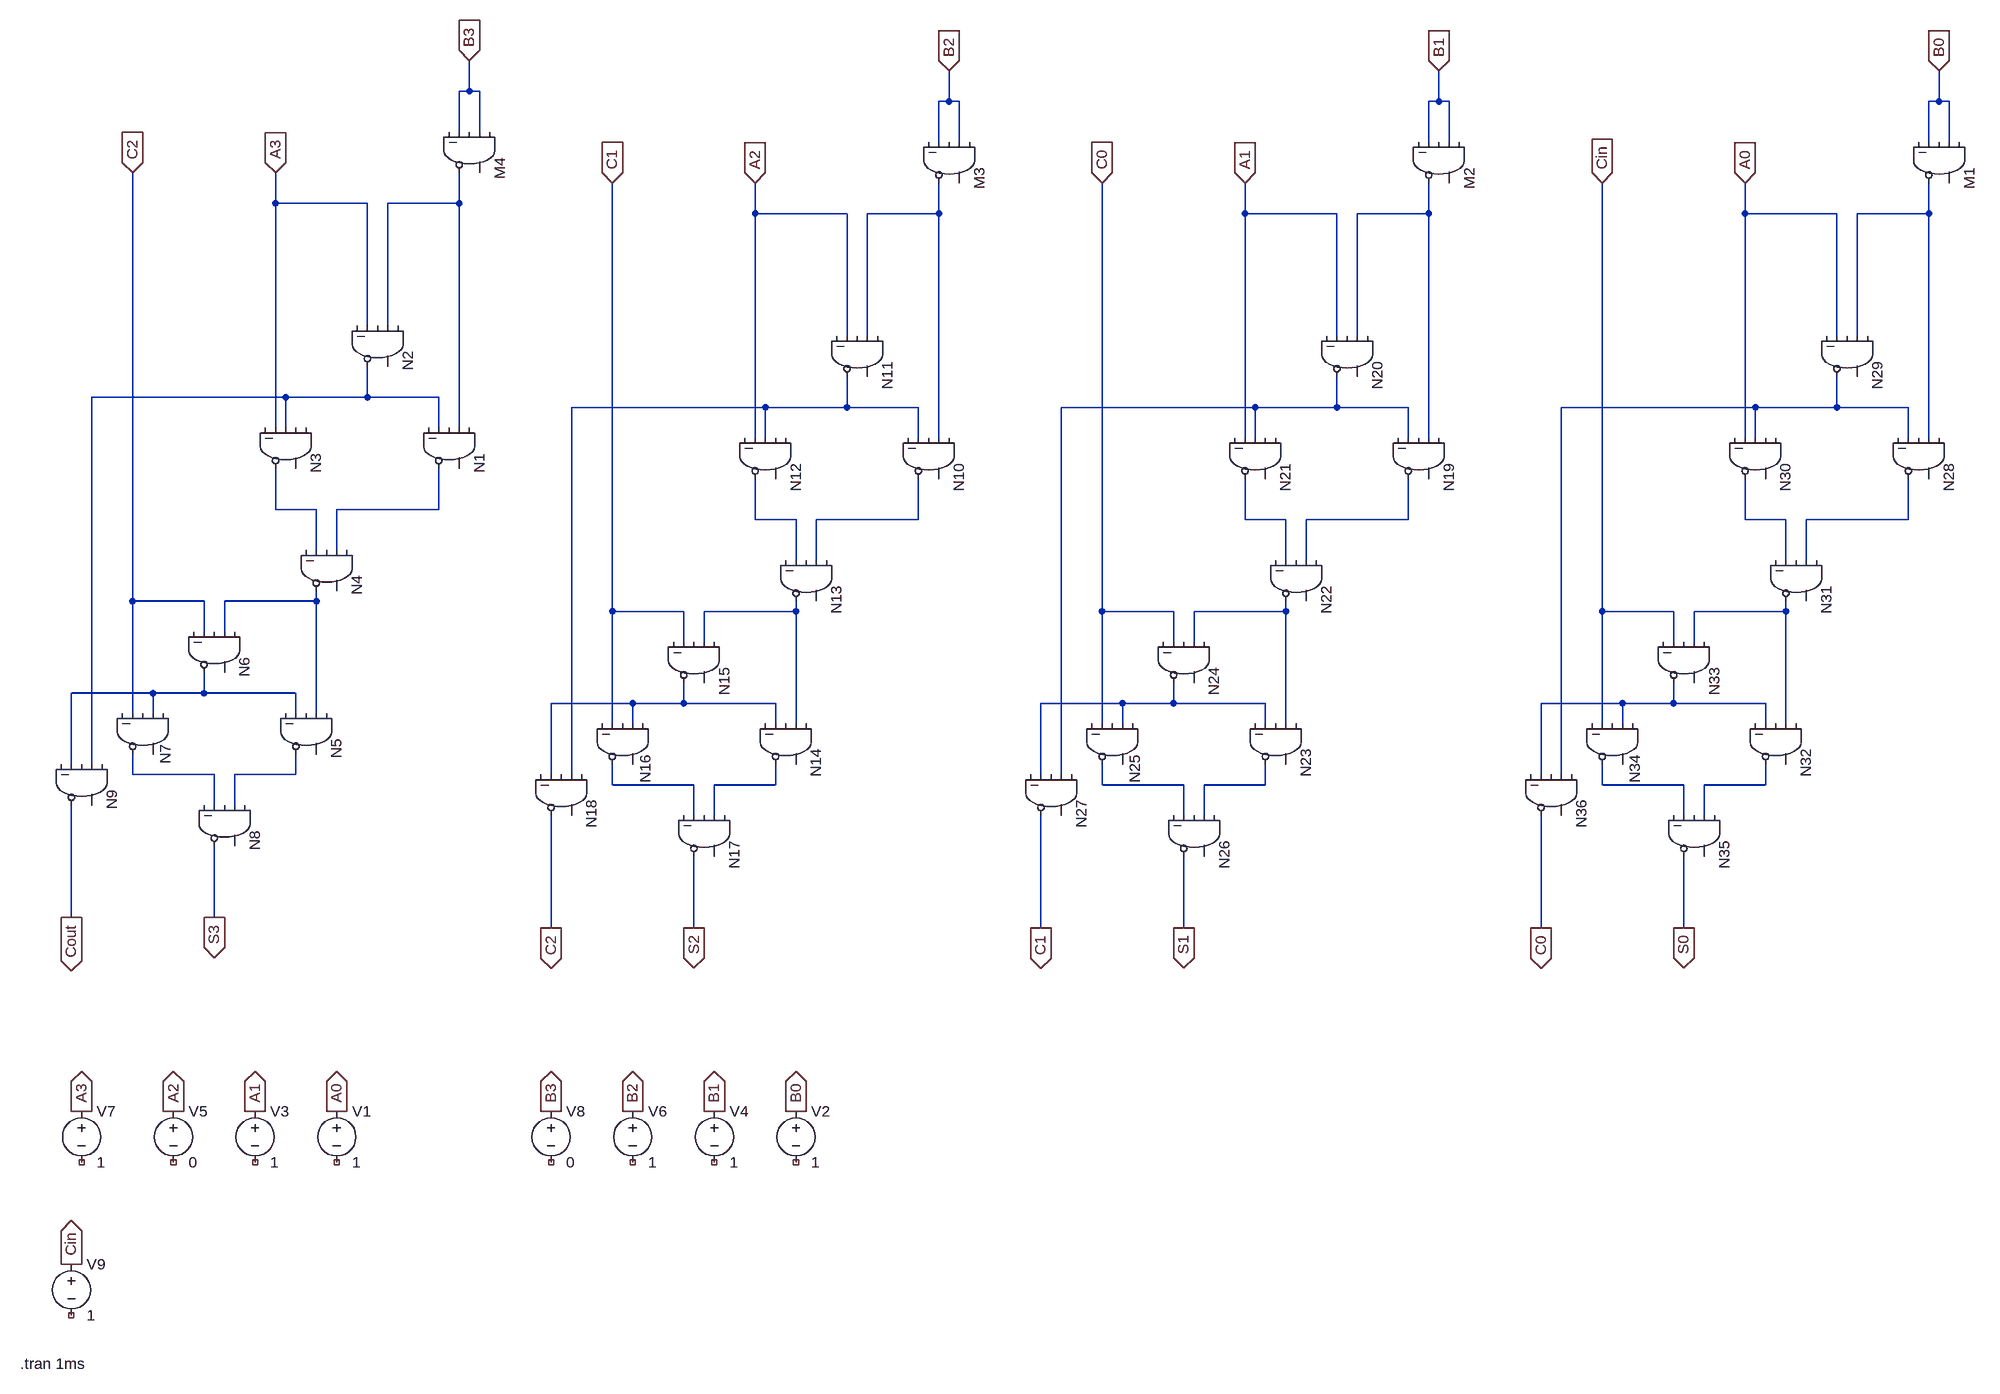
[diagram p0: schematic P3.asc]
P3.asc, the LTspice schematic file:
Version 4
SHEET 1 4360 2320
WIRE 1984 -2144 1984 -2192
WIRE 1984 -2144 1968 -2144
WIRE 2000 -2144 1984 -2144
WIRE 2736 -2128 2736 -2176
WIRE 2736 -2128 2720 -2128
WIRE 2752 -2128 2736 -2128
WIRE 3504 -2128 3504 -2176
WIRE 3504 -2128 3488 -2128
WIRE 3520 -2128 3504 -2128
WIRE 4288 -2128 4288 -2176
WIRE 4288 -2128 4272 -2128
WIRE 4304 -2128 4288 -2128
WIRE 1968 -2080 1968 -2144
WIRE 2000 -2080 2000 -2144
WIRE 2720 -2064 2720 -2128
WIRE 2752 -2064 2752 -2128
WIRE 3488 -2064 3488 -2128
WIRE 3520 -2064 3520 -2128
WIRE 4272 -2064 4272 -2128
WIRE 4304 -2064 4304 -2128
WIRE 1680 -1968 1680 -2016
WIRE 1824 -1968 1680 -1968
WIRE 1968 -1968 1968 -2016
WIRE 1968 -1968 1856 -1968
WIRE 2432 -1952 2432 -2000
WIRE 2576 -1952 2432 -1952
WIRE 2720 -1952 2720 -2000
WIRE 2720 -1952 2608 -1952
WIRE 3200 -1952 3200 -2000
WIRE 3344 -1952 3200 -1952
WIRE 3488 -1952 3488 -2000
WIRE 3488 -1952 3376 -1952
WIRE 3984 -1952 3984 -2000
WIRE 4128 -1952 3984 -1952
WIRE 4272 -1952 4272 -2000
WIRE 4272 -1952 4160 -1952
WIRE 1824 -1776 1824 -1968
WIRE 1856 -1776 1856 -1968
WIRE 2576 -1760 2576 -1952
WIRE 2608 -1760 2608 -1952
WIRE 3344 -1760 3344 -1952
WIRE 3376 -1760 3376 -1952
WIRE 4128 -1760 4128 -1952
WIRE 4160 -1760 4160 -1952
WIRE 1696 -1664 1392 -1664
WIRE 1824 -1664 1824 -1712
WIRE 1824 -1664 1696 -1664
WIRE 1936 -1664 1824 -1664
WIRE 2448 -1648 2144 -1648
WIRE 2576 -1648 2576 -1696
WIRE 2576 -1648 2448 -1648
WIRE 2688 -1648 2576 -1648
WIRE 3216 -1648 2912 -1648
WIRE 3344 -1648 3344 -1696
WIRE 3344 -1648 3216 -1648
WIRE 3456 -1648 3344 -1648
WIRE 4000 -1648 3696 -1648
WIRE 4128 -1648 4128 -1696
WIRE 4128 -1648 4000 -1648
WIRE 4240 -1648 4128 -1648
WIRE 1680 -1616 1680 -1968
WIRE 1696 -1616 1696 -1664
WIRE 1936 -1616 1936 -1664
WIRE 1968 -1616 1968 -1968
WIRE 2432 -1600 2432 -1952
WIRE 2448 -1600 2448 -1648
WIRE 2688 -1600 2688 -1648
WIRE 2720 -1600 2720 -1952
WIRE 3200 -1600 3200 -1952
WIRE 3216 -1600 3216 -1648
WIRE 3456 -1600 3456 -1648
WIRE 3488 -1600 3488 -1952
WIRE 3984 -1600 3984 -1952
WIRE 4000 -1600 4000 -1648
WIRE 4240 -1600 4240 -1648
WIRE 4272 -1600 4272 -1952
WIRE 1680 -1488 1680 -1552
WIRE 1744 -1488 1680 -1488
WIRE 1936 -1488 1936 -1552
WIRE 1936 -1488 1776 -1488
WIRE 2432 -1472 2432 -1536
WIRE 2496 -1472 2432 -1472
WIRE 2688 -1472 2688 -1536
WIRE 2688 -1472 2528 -1472
WIRE 3200 -1472 3200 -1536
WIRE 3264 -1472 3200 -1472
WIRE 3456 -1472 3456 -1536
WIRE 3456 -1472 3296 -1472
WIRE 3984 -1472 3984 -1536
WIRE 4048 -1472 3984 -1472
WIRE 4240 -1472 4240 -1536
WIRE 4240 -1472 4080 -1472
WIRE 1744 -1424 1744 -1488
WIRE 1776 -1424 1776 -1488
WIRE 2496 -1408 2496 -1472
WIRE 2528 -1408 2528 -1472
WIRE 3264 -1408 3264 -1472
WIRE 3296 -1408 3296 -1472
WIRE 4048 -1408 4048 -1472
WIRE 4080 -1408 4080 -1472
WIRE 1456 -1344 1456 -2016
WIRE 1568 -1344 1456 -1344
WIRE 1744 -1344 1744 -1360
WIRE 1744 -1344 1600 -1344
WIRE 2208 -1328 2208 -2000
WIRE 2320 -1328 2208 -1328
WIRE 2496 -1328 2496 -1344
WIRE 2496 -1328 2352 -1328
WIRE 2976 -1328 2976 -2000
WIRE 3088 -1328 2976 -1328
WIRE 3264 -1328 3264 -1344
WIRE 3264 -1328 3120 -1328
WIRE 3760 -1328 3760 -2000
WIRE 3872 -1328 3760 -1328
WIRE 4048 -1328 4048 -1344
WIRE 4048 -1328 3904 -1328
WIRE 1568 -1296 1568 -1344
WIRE 1600 -1296 1600 -1344
WIRE 2320 -1280 2320 -1328
WIRE 2352 -1280 2352 -1328
WIRE 3088 -1280 3088 -1328
WIRE 3120 -1280 3120 -1328
WIRE 3872 -1280 3872 -1328
WIRE 3904 -1280 3904 -1328
WIRE 1488 -1200 1360 -1200
WIRE 1568 -1200 1568 -1232
WIRE 1568 -1200 1488 -1200
WIRE 1712 -1200 1568 -1200
WIRE 2240 -1184 2112 -1184
WIRE 2320 -1184 2320 -1216
WIRE 2320 -1184 2240 -1184
WIRE 2464 -1184 2320 -1184
WIRE 3008 -1184 2880 -1184
WIRE 3088 -1184 3088 -1216
WIRE 3088 -1184 3008 -1184
WIRE 3232 -1184 3088 -1184
WIRE 3792 -1184 3664 -1184
WIRE 3872 -1184 3872 -1216
WIRE 3872 -1184 3792 -1184
WIRE 4016 -1184 3872 -1184
WIRE 1456 -1168 1456 -1344
WIRE 1488 -1168 1488 -1200
WIRE 1712 -1168 1712 -1200
WIRE 1744 -1168 1744 -1344
WIRE 2208 -1152 2208 -1328
WIRE 2240 -1152 2240 -1184
WIRE 2464 -1152 2464 -1184
WIRE 2496 -1152 2496 -1328
WIRE 2976 -1152 2976 -1328
WIRE 3008 -1152 3008 -1184
WIRE 3232 -1152 3232 -1184
WIRE 3264 -1152 3264 -1328
WIRE 3760 -1152 3760 -1328
WIRE 3792 -1152 3792 -1184
WIRE 4016 -1152 4016 -1184
WIRE 4048 -1152 4048 -1328
WIRE 1360 -1088 1360 -1200
WIRE 1392 -1088 1392 -1664
WIRE 1456 -1072 1456 -1104
WIRE 1584 -1072 1456 -1072
WIRE 1712 -1072 1712 -1104
WIRE 1712 -1072 1616 -1072
WIRE 2112 -1072 2112 -1184
WIRE 2144 -1072 2144 -1648
WIRE 2880 -1072 2880 -1184
WIRE 2912 -1072 2912 -1648
WIRE 3664 -1072 3664 -1184
WIRE 3696 -1072 3696 -1648
WIRE 2208 -1056 2208 -1088
WIRE 2336 -1056 2208 -1056
WIRE 2464 -1056 2464 -1088
WIRE 2464 -1056 2368 -1056
WIRE 2976 -1056 2976 -1088
WIRE 3104 -1056 2976 -1056
WIRE 3232 -1056 3232 -1088
WIRE 3232 -1056 3136 -1056
WIRE 3760 -1056 3760 -1088
WIRE 3888 -1056 3760 -1056
WIRE 4016 -1056 4016 -1088
WIRE 4016 -1056 3920 -1056
WIRE 1584 -1024 1584 -1072
WIRE 1616 -1024 1616 -1072
WIRE 2336 -1008 2336 -1056
WIRE 2368 -1008 2368 -1056
WIRE 3104 -1008 3104 -1056
WIRE 3136 -1008 3136 -1056
WIRE 3888 -1008 3888 -1056
WIRE 3920 -1008 3920 -1056
WIRE 1360 -848 1360 -1024
WIRE 1584 -848 1584 -960
WIRE 2112 -832 2112 -1008
WIRE 2336 -832 2336 -944
WIRE 2880 -832 2880 -1008
WIRE 3104 -832 3104 -944
WIRE 3664 -832 3664 -1008
WIRE 3888 -832 3888 -944
FLAG 1680 -2016 A3
IOPIN 1680 -2016 In
FLAG 1456 -2016 C2
IOPIN 1456 -2016 In
FLAG 1584 -848 S3
IOPIN 1584 -848 Out
FLAG 1360 -848 Cout
IOPIN 1360 -848 Out
FLAG 2432 -2000 A2
IOPIN 2432 -2000 In
FLAG 2208 -2000 C1
IOPIN 2208 -2000 In
FLAG 2336 -832 S2
IOPIN 2336 -832 Out
FLAG 2112 -832 C2
IOPIN 2112 -832 Out
FLAG 3200 -2000 A1
IOPIN 3200 -2000 In
FLAG 2976 -2000 C0
IOPIN 2976 -2000 In
FLAG 3104 -832 S1
IOPIN 3104 -832 Out
FLAG 2880 -832 C1
IOPIN 2880 -832 Out
FLAG 3984 -2000 A0
IOPIN 3984 -2000 In
FLAG 3760 -2000 Cin
IOPIN 3760 -2000 In
FLAG 3888 -832 S0
IOPIN 3888 -832 Out
FLAG 3664 -832 C0
IOPIN 3664 -832 Out
FLAG 4288 -2176 B0
IOPIN 4288 -2176 In
FLAG 3504 -2176 B1
IOPIN 3504 -2176 In
FLAG 2736 -2176 B2
IOPIN 2736 -2176 In
FLAG 1984 -2192 B3
IOPIN 1984 -2192 In
FLAG 1776 -544 A0
IOPIN 1776 -544 Out
FLAG 2496 -544 B0
IOPIN 2496 -544 Out
FLAG 1648 -544 A1
IOPIN 1648 -544 Out
FLAG 2368 -544 B1
IOPIN 2368 -544 Out
FLAG 1520 -544 A2
IOPIN 1520 -544 Out
FLAG 2240 -544 B2
IOPIN 2240 -544 Out
FLAG 1376 -544 A3
IOPIN 1376 -544 Out
FLAG 2112 -544 B3
IOPIN 2112 -544 Out
FLAG 1360 -304 Cin
IOPIN 1360 -304 Out
SYMBOL Digital\\and 2016 -1584 R90
SYMATTR InstName N1
SYMBOL Digital\\and 1904 -1744 R90
SYMATTR InstName N2
SYMBOL Digital\\and 1760 -1584 R90
SYMATTR InstName N3
SYMBOL Digital\\and 1824 -1392 R90
SYMATTR InstName N4
SYMBOL Digital\\and 1792 -1136 R90
SYMATTR InstName N5
SYMBOL Digital\\and 1648 -1264 R90
SYMATTR InstName N6
SYMBOL Digital\\and 1536 -1136 R90
WINDOW 0 17 28 Left 2
SYMATTR InstName N7
SYMBOL Digital\\and 1664 -992 R90
SYMATTR InstName N8
SYMBOL Digital\\and 1440 -1056 R90
SYMATTR InstName N9
SYMBOL Digital\\and 2768 -1568 R90
SYMATTR InstName N10
SYMBOL Digital\\and 2656 -1728 R90
SYMATTR InstName N11
SYMBOL Digital\\and 2512 -1568 R90
SYMATTR InstName N12
SYMBOL Digital\\and 2576 -1376 R90
SYMATTR InstName N13
SYMBOL Digital\\and 2544 -1120 R90
SYMATTR InstName N14
SYMBOL Digital\\and 2400 -1248 R90
SYMATTR InstName N15
SYMBOL Digital\\and 2288 -1120 R90
WINDOW 0 17 28 Left 2
SYMATTR InstName N16
SYMBOL Digital\\and 2416 -976 R90
SYMATTR InstName N17
SYMBOL Digital\\and 2192 -1040 R90
SYMATTR InstName N18
SYMBOL Digital\\and 3536 -1568 R90
SYMATTR InstName N19
SYMBOL Digital\\and 3424 -1728 R90
SYMATTR InstName N20
SYMBOL Digital\\and 3280 -1568 R90
SYMATTR InstName N21
SYMBOL Digital\\and 3344 -1376 R90
SYMATTR InstName N22
SYMBOL Digital\\and 3312 -1120 R90
SYMATTR InstName N23
SYMBOL Digital\\and 3168 -1248 R90
SYMATTR InstName N24
SYMBOL Digital\\and 3056 -1120 R90
WINDOW 0 17 28 Left 2
SYMATTR InstName N25
SYMBOL Digital\\and 3184 -976 R90
SYMATTR InstName N26
SYMBOL Digital\\and 2960 -1040 R90
SYMATTR InstName N27
SYMBOL Digital\\and 4320 -1568 R90
SYMATTR InstName N28
SYMBOL Digital\\and 4208 -1728 R90
SYMATTR InstName N29
SYMBOL Digital\\and 4064 -1568 R90
SYMATTR InstName N30
SYMBOL Digital\\and 4128 -1376 R90
SYMATTR InstName N31
SYMBOL Digital\\and 4096 -1120 R90
SYMATTR InstName N32
SYMBOL Digital\\and 3952 -1248 R90
SYMATTR InstName N33
SYMBOL Digital\\and 3840 -1120 R90
WINDOW 0 17 28 Left 2
SYMATTR InstName N34
SYMBOL Digital\\and 3968 -976 R90
SYMATTR InstName N35
SYMBOL Digital\\and 3744 -1040 R90
SYMATTR InstName N36
SYMBOL Digital\\and 4352 -2032 R90
SYMATTR InstName M1
SYMBOL Digital\\and 3568 -2032 R90
SYMATTR InstName M2
SYMBOL Digital\\and 2800 -2032 R90
SYMATTR InstName M3
SYMBOL Digital\\and 2048 -2048 R90
SYMATTR InstName M4
SYMBOL voltage 1776 -560 R0
WINDOW 123 0 0 Left 0
WINDOW 39 0 0 Left 0
SYMATTR InstName V1
SYMATTR Value 1
SYMBOL voltage 2496 -560 R0
WINDOW 123 0 0 Left 0
WINDOW 39 0 0 Left 0
SYMATTR InstName V2
SYMATTR Value 1
SYMBOL voltage 1648 -560 R0
WINDOW 123 0 0 Left 0
WINDOW 39 0 0 Left 0
SYMATTR InstName V3
SYMATTR Value 1
SYMBOL voltage 2368 -560 R0
WINDOW 123 0 0 Left 0
WINDOW 39 0 0 Left 0
SYMATTR InstName V4
SYMATTR Value 1
SYMBOL voltage 1520 -560 R0
WINDOW 123 0 0 Left 0
WINDOW 39 0 0 Left 0
SYMATTR InstName V5
SYMATTR Value 0
SYMBOL voltage 2240 -560 R0
WINDOW 123 0 0 Left 0
WINDOW 39 0 0 Left 0
SYMATTR InstName V6
SYMATTR Value 1
SYMBOL voltage 1376 -560 R0
WINDOW 123 0 0 Left 0
WINDOW 39 0 0 Left 0
SYMATTR InstName V7
SYMATTR Value 1
SYMBOL voltage 2112 -560 R0
WINDOW 123 0 0 Left 0
WINDOW 39 0 0 Left 0
SYMATTR InstName V8
SYMATTR Value 0
SYMBOL voltage 1360 -320 R0
WINDOW 123 0 0 Left 0
WINDOW 39 0 0 Left 0
SYMATTR InstName V9
SYMATTR Value 1
TEXT 1280 -148 Left 2 !.tran 1ms

The netlist it stands for:
* P3.asc
A§N1 0 N001 0 N005 0 N010 0 0 AND
A§N2 0 N001 0 A3 0 N005 0 0 AND
A§N3 0 0 N005 A3 0 N009 0 0 AND
A§N4 0 N010 0 N009 0 N017 0 0 AND
A§N5 0 N017 0 N021 0 N026 0 0 AND
A§N6 0 N017 0 C2 0 N021 0 0 AND
A§N7 0 N021 0 C2 0 N025 0 0 AND
A§N8 0 N026 0 N025 0 S3 0 0 AND
A§N9 0 N005 0 N021 0 Cout 0 0 AND
A§N10 0 N002 0 N006 0 N012 0 0 AND
A§N11 0 N002 0 A2 0 N006 0 0 AND
A§N12 0 0 N006 A2 0 N011 0 0 AND
A§N13 0 N012 0 N011 0 N018 0 0 AND
A§N14 0 N018 0 N022 0 N028 0 0 AND
A§N15 0 N018 0 C1 0 N022 0 0 AND
A§N16 0 N022 0 C1 0 N027 0 0 AND
A§N17 0 N028 0 N027 0 S2 0 0 AND
A§N18 0 N006 0 N022 0 C2 0 0 AND
A§N19 0 N003 0 N007 0 N014 0 0 AND
A§N20 0 N003 0 A1 0 N007 0 0 AND
A§N21 0 0 N007 A1 0 N013 0 0 AND
A§N22 0 N014 0 N013 0 N019 0 0 AND
A§N23 0 N019 0 N023 0 N030 0 0 AND
A§N24 0 N019 0 C0 0 N023 0 0 AND
A§N25 0 N023 0 C0 0 N029 0 0 AND
A§N26 0 N030 0 N029 0 S1 0 0 AND
A§N27 0 N007 0 N023 0 C1 0 0 AND
A§N28 0 N004 0 N008 0 N016 0 0 AND
A§N29 0 N004 0 A0 0 N008 0 0 AND
A§N30 0 0 N008 A0 0 N015 0 0 AND
A§N31 0 N016 0 N015 0 N020 0 0 AND
A§N32 0 N020 0 N024 0 N032 0 0 AND
A§N33 0 N020 0 Cin 0 N024 0 0 AND
A§N34 0 N024 0 Cin 0 N031 0 0 AND
A§N35 0 N032 0 N031 0 S0 0 0 AND
A§N36 0 N008 0 N024 0 C0 0 0 AND
A§M1 0 B0 0 B0 0 N004 0 0 AND
A§M2 0 B1 0 B1 0 N003 0 0 AND
A§M3 0 B2 0 B2 0 N002 0 0 AND
A§M4 0 B3 0 B3 0 N001 0 0 AND
V1 A0 NC_01 1
V2 B0 NC_02 1
V3 A1 NC_03 1
V4 B1 NC_04 1
V5 A2 NC_05 0
V6 B2 NC_06 1
V7 A3 NC_07 1
V8 B3 NC_08 0
V9 Cin NC_09 1
.tran 1ms
.backanno
.end